# Altium schematic sheet IN-3 VALVE.SchDoc
size A4; SheetNumber: 8; SheetTotal: 9
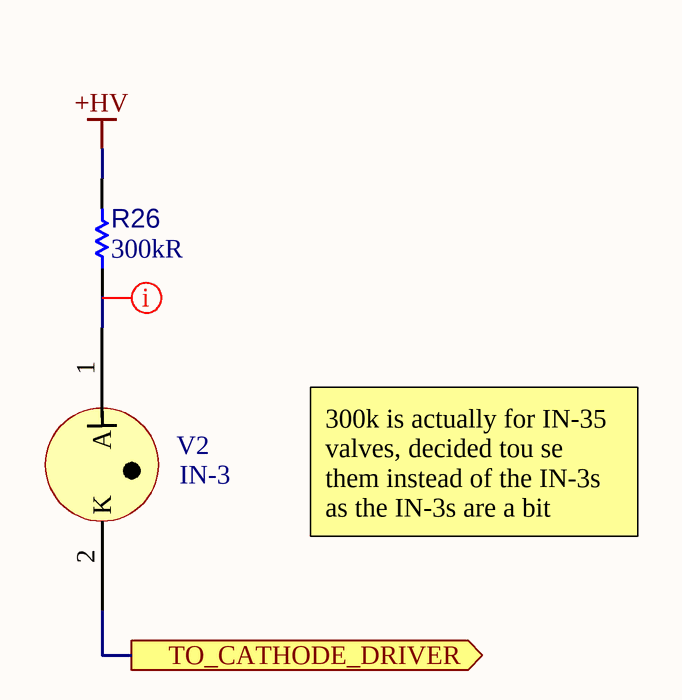
[diagram p0: IN-3 VALVE.SchDoc]

## Parts
?  (no value)
R26  value 300kR  [RESC3126X65X50NL10T20]  (hidden comment: SG73P2ETTD3003F)
V2  IN-3  [IN-3-Footprint-1]

## Ports
TO_CATHODE_DRIVER (out)

## Nets
+HV: R26.2
TO_CATHODE_DRIVER: V2.2(K) ; port TO_CATHODE_DRIVER
NetR26_1: R26.1 V2.1(A)

## Layout directives
net class HIGH VOLTAGE: NetR26_1

## Notes on the sheet
- 300k is actually for IN-35 valves, decided tou se them instead of the IN-3s as the IN-3s are a bit ugly(!)
- Project:
- Designer:
- Sheet
- of
- Filename:

## Library data of the parts
? = CMP-00003-4: The KETS Schematic Sheet Title Block
R26 = CMP-00405-2: Fixed Resistor, Metal Glaze/thick Film, 1.5W, 300000ohm, 200V, 1% +/-Tol, 200ppm/Cel, Surface Mount, 1210; Power Rating: 500mW; Temperature Coefficient: 200ppm/°C; RoHS: Compliant; Working Voltage: 200V; Case/Package: 1210; Lifecycle Status: Production; Max Operating Temperature: 155°C; Tolerance: 1%; Min Operating Temperature: -55°C; Pins: 2; Termination: SMD/SMT; Power Dissipation: 500mW; Case Code (Metric): 3225; Voltage Rating: 200V; Width: 2.6mm; Power: 1.5W; China RoHS: Non-Compliant; REACH SVHC: Yes; Mounting Technology: Surface Mount; Voltage Rating (DC): 200V; Height: 600µm; Case Code (Imperial): 1210; Number of Terminals: 2
V2 = CMP-00026-00007-7: IN-3 Cold Cathode Indicator Valve; Pins: 2; RoHS Compliant: Yes; Mounting Technology: THT